# EAGLE design 89c2051-ps2-dec (EAGLE 4.16)
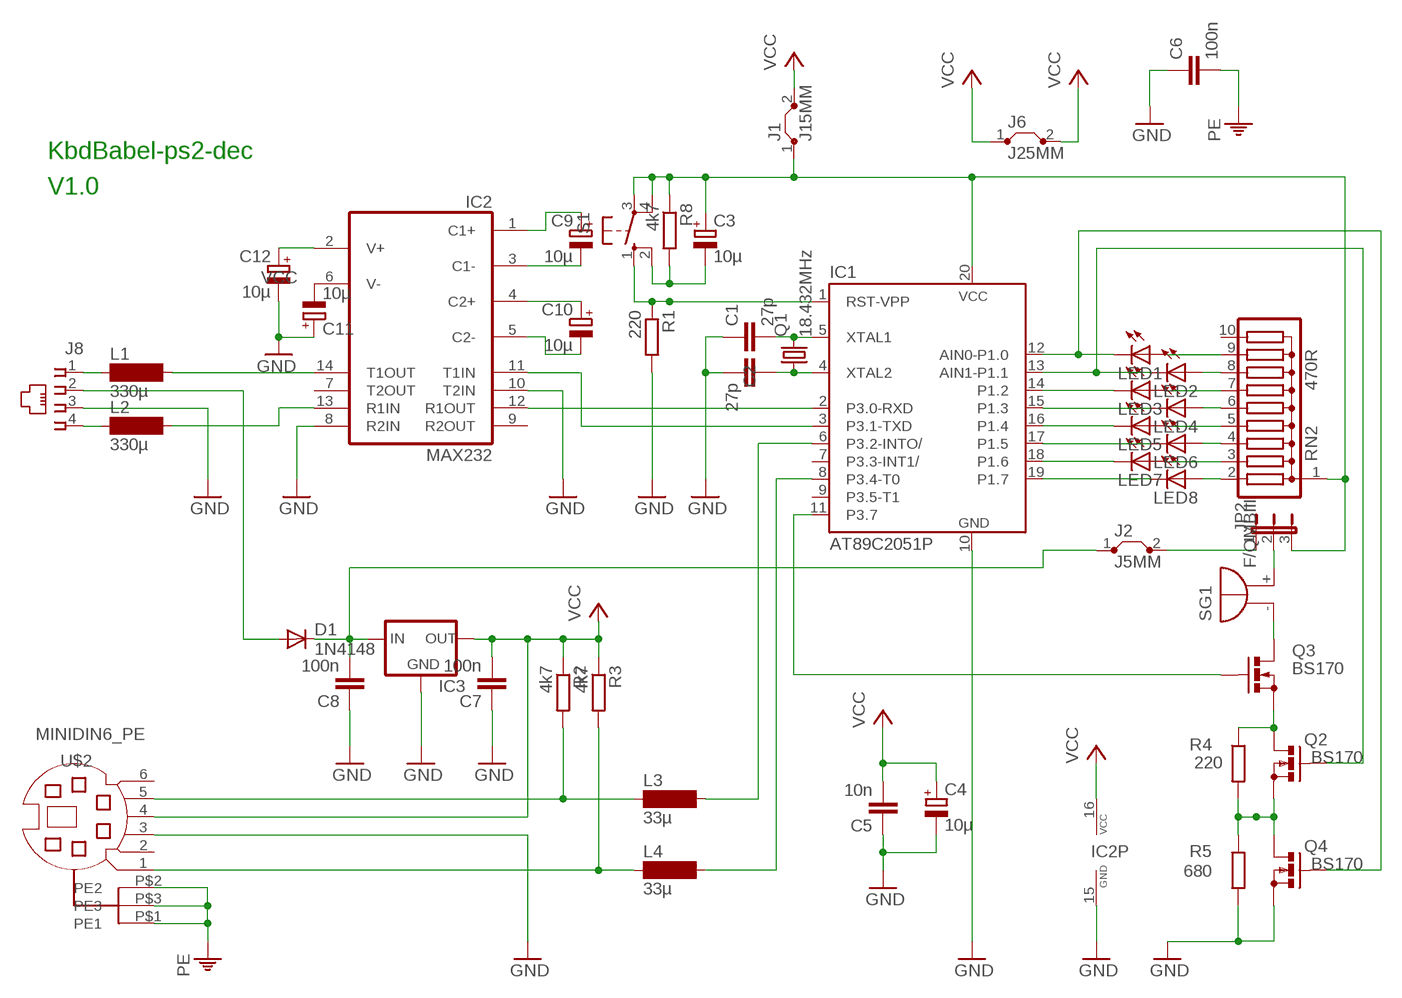
[diagram p0: schematic, sheet 1]

## Parts
C1  27p  C-EU025-030X050  [C025-030X050]
C2  27p  C-EU025-030X050  [C025-030X050]
C3  10µ  CPOL-EUE2.5-5  [E2,5-5]
C4  10µ  CPOL-EUE2.5-5  [E2,5-5]
C5  10n  C-EU025_050-025X075  [C025_050-025X075]
C6  100n  C-EU025_050-025X075  [C025_050-025X075]
C7  100n  C-EU025_050-025X075  [C025_050-025X075]
C8  100n  C-EU025_050-025X075  [C025_050-025X075]
C9  10µ  CPOL-EUE5-5  [E5-5]
C10  10µ  CPOL-EUE2-4  [E2-4]
C11  10µ  CPOL-EUE2-4  [E2-4]
C12  10µ  CPOL-EUE2-4  [E2-4]
D1  1N4148  [DO35-10]
IC1  AT89C2051P  [DIL20]
IC2  MAX232  [DIL16]
IC3  78XXL  [78XXL]
J1  J15MM  [15]
J2  J5MM  [05]
J6  J25MM  [25]
J8  520249-2  [520249-2]
JP2  JP2E  [JP2]
L1  330µ  SD75  [SD75]
L2  330µ  SD75  [SD75]
L3  33µ  SD75  [SD75]
L4  33µ  SD75  [SD75]
LED1  LEDSQR2X5  [LED2X5]
LED2  LEDSQR2X5  [LED2X5]
LED3  LEDSQR2X5  [LED2X5]
LED4  LEDSQR2X5  [LED2X5]
LED5  LEDSQR2X5  [LED2X5]
LED6  LEDSQR2X5  [LED2X5]
LED7  LEDSQR2X5  [LED2X5]
LED8  LEDSQR2X5  [LED2X5]
Q1  18.432MHz  CRYSTALHC49U70  [HC49U70]
Q2  BS170  [SOT54E]
Q3  BS170  [SOT54E]
Q4  BS170  [SOT54E]
R1  220  R-EU_0204/7  [0204/7]
R2  4k7  R-EU_0204/7  [0204/7]
R3  4k7  R-EU_0204/7  [0204/7]
R4  220  R-EU_0204/7  [0204/7]
R5  680  R-EU_0204/7  [0204/7]
R8  4k7  R-EU_0204/7  [0204/7]
RN2  470R  G09R  [SIL10]
S1  10-XX  [B3F-10XX]
SG1  F/QMBIII  [F/QMBIII]
U$2  MINIDIN6_PE  [MINIDIN6_PE]

## Nets
12VIN: C8.2 D1.C IC3.IN J2.1
GND: C1.1 C2.2 C4.- C5.1 C6.1 C7.1 C8.1 C11.+ C12.- IC1.10(GND) IC2.8(R2IN) IC2.10(T2IN) IC2.15(GND) IC3.GND J8.3 Q4.S R1.2 R5.2 U$2.3
N$1: C1.2 IC1.5(XTAL1) Q1.2
N$2: C2.1 IC1.4(XTAL2) Q1.1
N$4: LED1.A RN2.9
N$5: IC1.17(P1.5) LED6.K(C)
N$6: IC1.3(P3.1-TXD) IC2.11(T1IN)
N$7: J8.4 L2.1
N$8: IC1.13(AIN1-P1.1) LED2.K(C) Q2.G
N$9: IC2.13(R1IN) L2.2
N$10: C3.+ IC1.20(VCC) J1.1 JP2.3 R8.1 RN2.1 S1.3(P) S1.4(P1)
N$11: L3.1 R2.2 U$2.5
N$12: L4.1 R3.2 U$2.1
N$13: IC1.12(AIN0-P1.0) LED1.K(C) Q4.G
N$14: LED3.A RN2.7
N$15: IC1.15(P1.3) LED4.K(C)
N$16: LED5.A RN2.5
N$17: LED2.A RN2.8
N$18: LED4.A RN2.6
N$19: LED6.A RN2.4
N$20: IC1.18(P1.6) LED7.K(C)
N$21: LED8.A RN2.2
N$22: LED7.A RN2.3
N$23: IC1.19(P1.7) LED8.K(C)
N$24: IC1.16(P1.4) LED5.K(C)
N$25: IC1.14(P1.2) LED3.K(C)
N$26: IC1.2(P3.0-RXD) IC2.12(R1OUT)
N$28: IC1.11(P3.7) Q3.G
N$30: C10.+ IC2.4(C2+)
N$31: C10.- IC2.5(C2-)
N$32: J8.1 L1.1
N$33: C9.- IC2.3(C1-)
N$34: C9.+ IC2.1(C1+)
N$35: C11.- IC2.6(V-)
N$36: C12.+ IC2.2(V+)
N$39: IC2.14(T1OUT) L1.2
N$41: D1.A J8.2
N$42: J2.2 JP2.1
N$43: C3.- R8.2 S1.2(S1)
N$44: JP2.2 SG1.+(-)
N$45: Q2.D Q3.S R4.1
N$46: Q3.D SG1.-(+)
N$48: IC1.6(P3.2-INTO/) L3.2
N$49: IC1.8(P3.4-T0) L4.2
N$50: Q2.S Q4.D R4.2 R5.1
PE: C6.2 U$2.P$1(PE1) U$2.P$2(PE2) U$2.P$3(PE3)
RST: IC1.1(RST-VPP) R1.1 S1.1(S)
VCC: C4.+ C5.2 C7.2 IC2.16(VCC) IC3.OUT J1.2 J6.1 J6.2 R2.1 R3.1 U$2.4
Unconnected: IC1.7(P3.3-INT1/) IC1.9(P3.5-T1) IC2.7(T2OUT) IC2.9(R2OUT) RN2.10 U$2.2 U$2.6

## Notes on the sheet
- KbdBabel-ps2-dec
- V1.0

## Library data of the parts
C1 C2 C5-C8 = rcl:C-EU: CAPACITOR, European symbol
C3 C4 C9-C12 = rcl:CPOL-EU: POLARIZED CAPACITOR, European symbol
D1 = diode:1N4148: DIODE high speed (Philips)
IC1 = atmel:AT89C2051: 80C31 MICROCONTROLLER 2 Kbytes FLASH 2.7 V
IC2 = maxim:MAX232: RS232 TRANSEIVER
IC3 = v-reg:78XXL: VOLTAGE REGULATOR
J1 J2 J6 = jumper:J: Bridge
J8 = con-amp:520249-2: AMP connector
JP2 = jumper:JP2E: JUMPER
L1-L4 = inductor-neosid:SD75: INDUCTOR nominal inductance, E12
LED1-LED8 = led:LED: LED OSRAM: - CHIPLED LG R971, LG N971, LY N971, LG Q971, LY Q971, LO R971, LY R971 LH N974, LH R974 LS Q976, LO Q976, LY Q976 LO Q996 - Hyper CHIPLED LW Q18S LB Q993, LB Q99A, LB R99A - SideLED LS A670, LO A670, LY A670, LG A670, LP A670 LB A673, LV A673, LT A673, LW A673 LH A674 LY A675 LS A676, LA A676, LO A676, LY A676, LW A676 LS A679, LY A679, LG A679 - Hyper Micro SIDELED® LS Y876, LA Y876, LO Y876, LY Y876 LT Y87S - SmartLED LW L88C, LW L88S LB L89C, LB L89S, LG L890 LS L89K, LO L89K, LY L89K LS L896, LA L896, LO L896, LY L896 - TOPLED LS T670, LO T670, LY T670, LG T670, LP T670 LSG T670, LSP T670, LSY T670, LOP T670, LYG T670 LG T671, LOG T671, LSG T671 LB T673, LV T673, LT T673, LW T673 LH T674 LS T676, LA T676, LO T676, LY T676, LB T676, LH T676, LSB T676, LW T676 LB T67C, LV T67C, LT T67C, LS T67K, LO T67K, LY T67K, LW E67C LS E67B, LA E67B, LO E67B, LY E67B, LB E67C, LV E67C, LT E67C LW T67C LS T679, LY T679, LG T679 LS T770, LO T770, LY T770, LG T770, LP T770 LB T773, LV T773, LT T773, LW T773 LH T774 LS E675, LA E675, LY E675, LS T675 LS T776, LA T776, LO T776, LY T776, LB T776 LHGB T686 LT T68C, LB T68C - Hyper Mini TOPLED® LB M676 - Mini TOPLED Santana® LG M470 LS M47K, LO M47K, LY M47K Source: http://www.osram.convergy.de - LUMILED® LXK2-PW12-R00, LXK2-PW12-S00, LXK2-PW14-U00, LXK2-PW14-V00 LXK2-PM12-R00, LXK2-PM12-S00, LXK2-PM14-U00 LXK2-PE12-Q00, LXK2-PE12-R00, LXK2-PE12-S00, LXK2-PE14-T00, LXK2-PE14-U00 LXK2-PB12-K00, LXK2-PB12-L00, LXK2-PB12-M00, LXK2-PB14-N00, LXK2-PB14-P00, LXK2-PB14-Q00 LXK2-PR12-L00, LXK2-PR12-M00, LXK2-PR14-Q00, LXK2-PR14-R00 LXK2-PD12-Q00, LXK2-PD12-R00, LXK2-PD12-S00 LXK2-PH12-R00, LXK2-PH12-S00 LXK2-PL12-P00, LXK2-PL12-Q00, LXK2-PL12-R00 Source: www.luxeon.com
Q1 = crystal:CRYSTAL: CRYSTAL
Q2-Q4 = transistor-small-signal:BS170: N-CHANNEL MOS FET
R1-R5 R8 = rcl:R-EU_: RESISTOR, European symbol
RN2 = resistor-sil:G09R: SIL RESISTOR
S1 = switch-omron:10-XX: OMRON SWITCH
SG1 = buzzer:F/QMBIII: BUZZER Source: Buerklin
U$2 = bla:MINIDIN6_PE

## Board
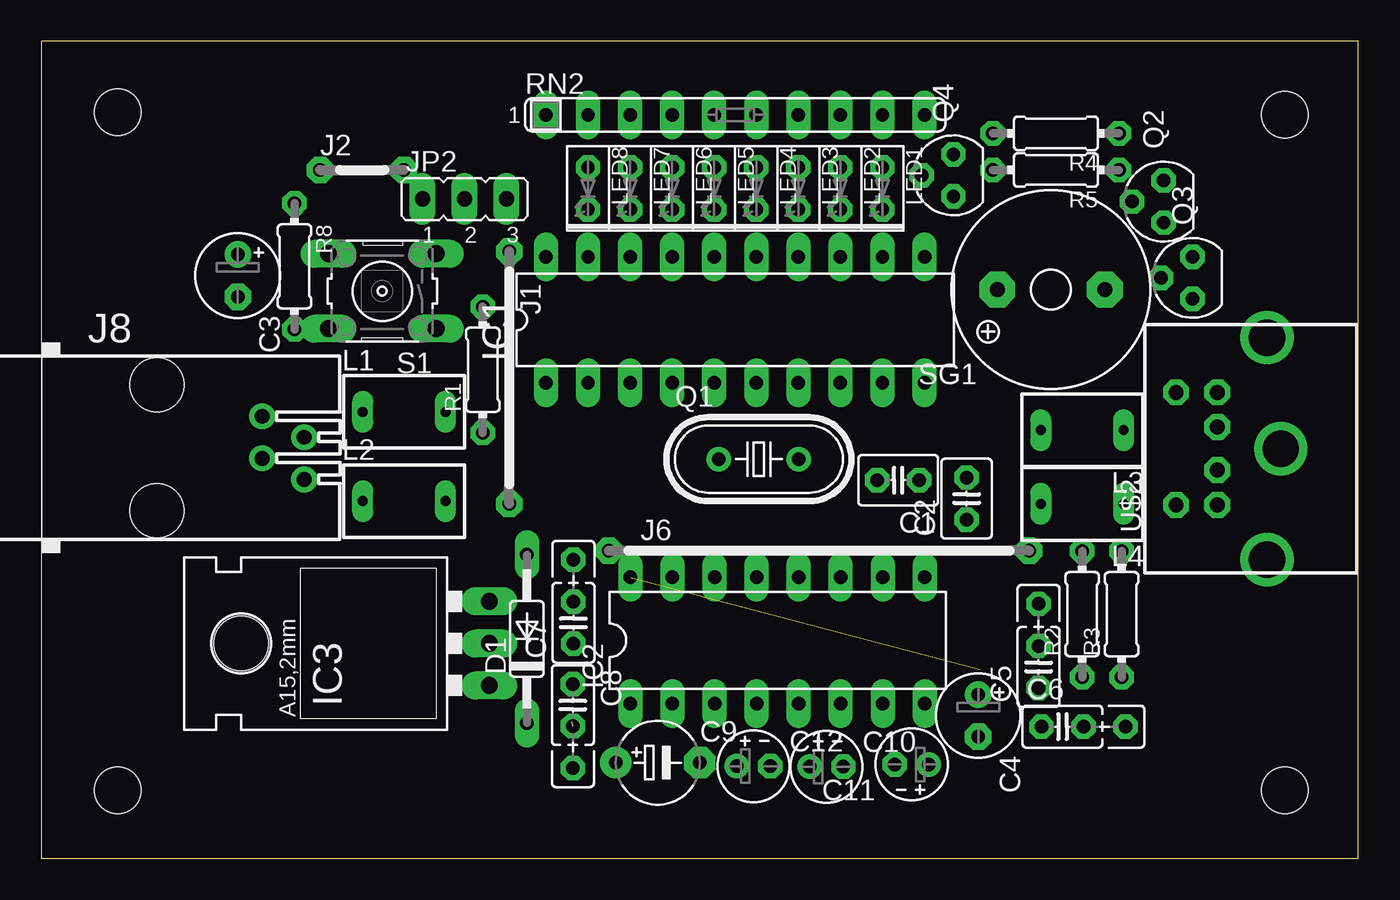
[diagram p1: board, top side]
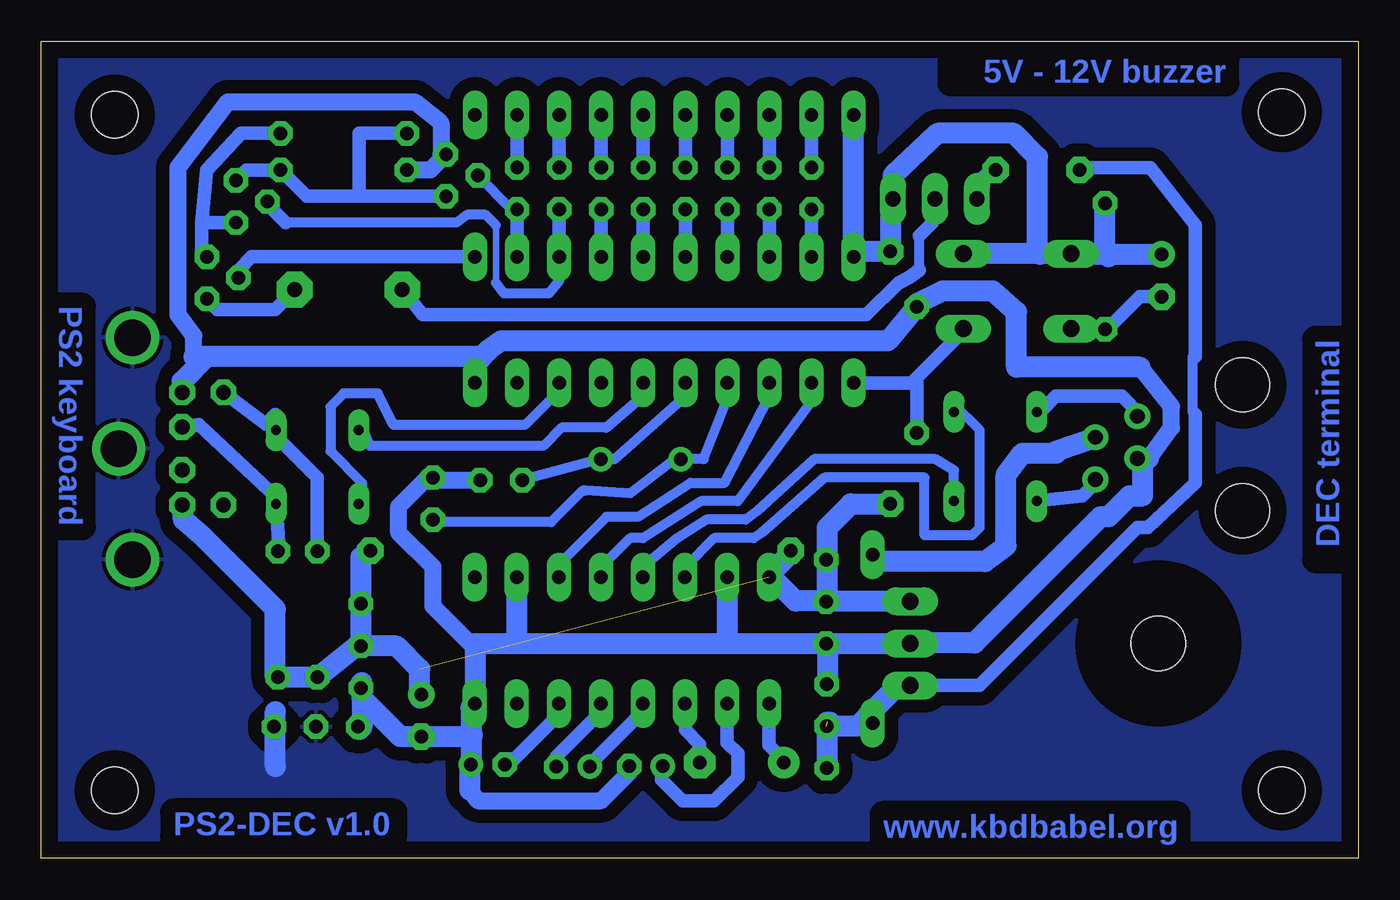
[diagram p2: board, bottom side, seen from below]

Size 79.52 x 49.36 mm. Coordinates in mm from the lower left corner, seen from the top.
Outline: 79.52,0 79.52,49.36 0,49.36 0,0 79.52,0
Copper layers (1*16): Top 0.035mm / dielectric 1.5mm / Bottom 0.035mm
Design rules "default": minimum track width 16mil, minimum drill 24mil, track to track 16mil, track to pad 16mil, pad to pad 16mil, via to via 16mil, smd to smd 16mil, copper to edge 40mil, drill to drill 8mil, minimum pad ring 13mil, minimum via ring 8mil, stop-mask expansion 4mil, vias tented up to drill 0mil, thermal gap 10mil
Holes 2.8 mm at 75.08,4.12 75.08,44.92 4.6,45.08 4.6,4.12

### Footprints (pad centres in the part's own frame; a part is rotated, then mirrored left to right if it is on the bottom)
C025-030X050 = drill 0.813 octagon: 1 -1.27,0; 2 1.27,0
E2,5-5 = drill 0.813 pad 1.6 round: + -1.27,0 | drill 0.813 pad 1.6 octagon: - 1.27,0
C025_050-025X075 = drill 0.813 octagon: 1 -1.27,0; 2 1.27,0; 3 3.81,0
E5-5 = drill 0.813 pad 1.905 round: + -2.54,0 | drill 0.813 pad 1.905 octagon: - 2.54,0
E2-4 = drill 0.813 pad 1.27 round: + -1.016,0 | drill 0.813 pad 1.27 octagon: - 1.016,0
DO35-10 = drill 0.813 long: A 5.08,0; C -5.08,0
DIL20 = drill 0.813 long: 1 -11.43,-3.81; 2 -8.89,-3.81; 3 -6.35,-3.81; 4 -3.81,-3.81; 5 -1.27,-3.81; 6 1.27,-3.81; 7 3.81,-3.81; 8 6.35,-3.81; 9 8.89,-3.81; 10 11.43,-3.81; 11 11.43,3.81; 12 8.89,3.81; 13 6.35,3.81; 14 3.81,3.81; 15 1.27,3.81; 16 -1.27,3.81; 17 -3.81,3.81; 18 -6.35,3.81; 19 -8.89,3.81; 20 -11.43,3.81
DIL16 = drill 0.813 long: 1 -8.89,-3.81; 2 -6.35,-3.81; 3 -3.81,-3.81; 4 -1.27,-3.81; 5 1.27,-3.81; 6 3.81,-3.81; 7 6.35,-3.81; 8 8.89,-3.81; 9 8.89,3.81; 10 6.35,3.81; 11 3.81,3.81; 12 1.27,3.81; 13 -1.27,3.81; 14 -3.81,3.81; 15 -6.35,3.81; 16 -8.89,3.81
78XXL = drill 1.016 long: GND 0,-3.81; IN -2.54,-3.81; OUT 2.54,-3.81 | hole 3.302: 0,11.176
15 = drill 0.813 pad 1.6 octagon: 1 -7.62,0; 2 7.62,0
05 = drill 0.813 pad 1.6 octagon: 1 -2.54,0; 2 2.54,0
25 = drill 0.813 pad 1.6 octagon: 1 -12.7,0; 2 12.7,0
520249-2 = drill 0.889 round: 1 -1.905,6.35; 2 -0.635,8.89; 3 0.635,6.35; 4 1.905,8.89 | hole 3.251: -3.81,0; 3.81,0
JP2 = drill 0.914 long: 1 -2.54,0; 2 0,0; 3 2.54,0
SD75 = drill 0.6 long: 1 -2.5,0; 2 2.5,0
LED2X5 = drill 0.813 octagon: A -1.27,0; K 1.27,0
HC49U70 = drill 0.813 round: 1 -2.413,0; 2 2.413,0
SOT54E = drill 0.813 octagon: D -1.27,0; G 0,1.905; S 1.27,0
0204/7 = drill 0.813 octagon: 1 -3.81,0; 2 3.81,0
SIL10 = drill 0.813 long: 1 -11.43,0; 2 -8.89,0; 3 -6.35,0; 4 -3.81,0; 5 -1.27,0; 6 1.27,0; 7 3.81,0; 8 6.35,0; 9 8.89,0; 10 11.43,0
B3F-10XX = drill 1.016 long: 1 -3.251,2.261; 2 3.251,2.261; 3 -3.251,-2.261; 4 3.251,-2.261
F/QMBIII = drill 0.914 pad 2.159 octagon: + 3.251,0; - -3.251,0
MINIDIN6_PE = drill 0.9 octagon: 1 1.3,2.15; 2 -1.3,2.15; 3 3.4,2.15; 4 -3.4,2.15; 5 3.4,4.65; 6 -3.4,4.65 | drill 2.2 round: P$1 0,-1.676; P$2 -6.706,-0.838; P$3 6.706,-0.838

### Placement (x,y rotation side)
C1  51.75,22.85 180 top
C2  55.88,21.74 90 top
C3  11.86,35.21 270 top
C4  56.58,8.63 270 top
C5  60.22,11.57 90 top
C6  61.67,7.96 0 top
C7  32.13,14.24 90 top
C8  32.1,9.26 270 top
C9  37.22,5.79 0 top
C10  47.42,5.54 0 top
C11  52.56,5.68 180 top
C12  43.01,5.58 0 top
D1  29.32,13.27 90 top
IC1  41.9,32.54 0 top
IC2  44.46,13.18 0 top
IC3  23.24,12.99 90 top
J1  28.25,29.05 270 top
J2  19.36,41.59 0 top
J6  46.97,18.59 0 top
J8  6.98,24.8 270 top
JP2  25.55,39.84 0 top
L1  21.9,26.98 0 top
L2  21.9,21.58 0 top
L3  62.86,25.87 180 top
L4  62.86,21.43 180 top
LED1  50.79,40.48 270 top
LED2  48.25,40.48 270 top
LED3  45.71,40.48 270 top
LED4  43.17,40.48 270 top
LED5  40.63,40.48 270 top
LED6  38.09,40.48 270 top
LED7  35.55,40.48 270 top
LED8  33.01,40.48 270 top
Q1  43.33,24.12 0 top
Q2  67.78,39.68 90 top
Q3  69.53,35.08 90 top
Q4  55.08,41.27 90 top
R1  26.65,29.52 90 top
R2  62.86,14.76 90 top
R3  65.24,14.76 90 top
R4  61.27,43.81 180 top
R5  61.27,41.59 180 top
R8  15.29,35.77 270 top
RN2  41.9,44.92 0 top
S1  20.58,34.27 180 top
SG1  60.98,34.37 180 top
U$2  73.18,24.76 90 top

### Tracks (layer width: path | path; a pad name or v marks a point on that pad's centre or on a via)
12VIN  (1 unrouted)
  Bottom 0.61: 9.84,26.82 10,26.98 10,30.31 9.84,30.31
  Bottom 0.813: IC3.IN 22.87,10.45 13.33,20 12.69,20 9.84,22.69 9.84,26.82 | 9.84,30.31 9.84,38.25 12.54,41.74 16.82,41.74 J2.1
  Bottom 1.27: IC3.IN 27.8,10.45 29.21,9.04 | 29.21,9.04 29.36,8.88 29.32,8.84 D1.C 29.32,8.93 29.21,9.04 | C8.2 30.25,7.99 29.21,9.04 | 31.9,8.25 32.06,8.25 32.06,5.39
GND
  Bottom 1.016: C12.- 44.03,5.18 45.71,3.49 53.18,3.49 53.65,4.12 | C11.+ 53.58,5.63 53.49,5.55 53.65,5.39 | 12.65,24.17 11.27,26.03 11.27,27.3 13.17,29.68 | 53.34,12.97 53.61,12.97 55.88,15.23 55.88,17.61 57.94,19.68 57.94,21.27 56.19,23.01 C2.2 55.72,23.01 55.56,22.85 C1.1 | Q4.S 54.92,42.7 | 70.32,30.16 70.32,30.31 70.32,31.58 71.27,32.85 71.27,41.74 68.26,45.71 56.99,45.71 55.4,44.44 55.4,42.54 Q4.S | R5.2 56.03,41.59 Q4.S
  Bottom 1.27: 53.65,5.39 53.65,4.12 | 26.82,13.01 26.84,12.99 IC3.GND | 53.34,9.37 53.34,9.36 | 53.34,9.37 IC2.8 53.34,9.37 53.34,9.36 | 50.79,12.97 53.34,12.97 53.34,9.37 | IC2.10 50.79,16.99 50.79,12.97 | C7.1 38.09,12.97 | 38.09,12.97 50.79,12.97 | 32.06,10.53 32.06,10.47 | 32.06,10.53 C8.1 | C7.1 32.06,12.97 32.06,10.53 | 27.14,12.99 27.14,13.01 | IC3.GND 27.14,12.99 | C7.1 27.14,12.97 27.14,12.99 | IC2.15 38.09,16.99 38.09,12.97 | 13.17,29.68 20.63,29.68 20.63,33.01 22.06,34.28 25.08,34.28 26.67,33.49 R1.2 28.41,31.27 51.75,31.27 52.58,30.68 | 53.58,7.45 53.58,9.12 53.34,9.36 | 53.58,7.45 C11.+ | 53.58,7.45 53.49,7.45 53.59,7.36 C4.- 57.84,7.36 60.16,9.68 | C5.1 60.22,10.57 60.16,10.63 60.16,9.68 | 52.58,30.68 53.34,30 | 12.85,24.17 12.65,24.17 | 12.85,24.17 J8.3 | 12.85,24.17 12.85,24.12 13.01,24.12 13.01,21.9 13.81,21.9 15.08,20.63 15.55,20.63 23.17,13.01 26.98,13.01 27,12.99 IC3.GND | 53.02,30.16 52.54,30.68 52.58,30.68 | 53.02,30.16 53.18,30 | C6.1 60.4,7.85 60.32,7.77 60.16,7.93 60.16,9.68 | U$2.3 71.03,28.81 69.53,30.31 | 53.02,30.16 | 53.02,30.16 | 53.34,30.31 53.18,30.31 53.02,30.16 | 53.34,30.31 69.53,30.31 | 53.34,30.31 IC1.10 | 53.34,30.31 | 69.53,30.31 70.32,30.31 | C2.2
N$1
  Bottom 0.61: IC1.5 40.63,27.93 44.92,24.12 46.03,24.12 Q1.2 C1.2 | C1.2
N$2
  Bottom 0.61: IC1.4 38.09,27.77 39.52,24.12 41.27,24.12 | 41.27,24.12 Q1.1 | 41.27,24.12 43.97,22.06 46.67,22.22 46.83,22.22 48.73,20.31 56.03,20.31 C2.1 | C2.1
N$4
  Bottom 0.813: LED1.A RN2.9
N$5
  Bottom 0.813: IC1.17 LED6.K
N$6
  Bottom 0.61: IC1.3 35.55,27.93 38.25,22.69 40.32,22.69 43.49,20.63 45.4,20.63 48.25,17.77 48.25,16.98 48.27,16.96 | 48.27,16.96 48.41,16.82 | 48.27,16.96 IC2.11
N$7
  Bottom 0.813: J8.4 15.71,22.85 16.66,21.9 L2.1
N$8
  Bottom 0.406: 52.06,34.76 52.06,38.25
  Bottom 0.61: 64.77,38.41 54.45,38.41 53.81,38.89 52.7,38.89 52.06,38.25 | 52.06,34.76 51.59,34.12 48.89,34.12 48.25,34.92 IC1.13 | IC1.13
  Bottom 0.813: Q2.G 65.88,39.52 64.77,38.41 | IC1.13 LED2.K
N$9
  Bottom 0.61: 43.17,16.98 43.17,17.61 41.11,19.36 39.36,20.47 36.98,20.47 36.35,20.95 32.86,24.12 25.55,24.12 24.4,23.45 L2.2
  Bottom 0.813: 43.17,16.98 43.18,16.99 IC2.13
N$10
  Bottom 1.27: 23.81,36.66 23.81,36.53 S1.3 19.2,36.53 | S1.4 17.14,36.53 17.14,36.51 | S1.4 19.2,36.53 | S1.4 17.46,36.66 | S1.4 | C3.+ 15.08,36.48 | 15.08,36.48 17.27,36.48 S1.4 | 15.08,36.48 15.08,36.35 15.29,36.56 R8.1 | JP2.3 28.09,41.27 25.39,43.81 20.79,43.81 19.36,42.38 19.36,36.66 19.2,36.51 19.2,36.53 | IC1.20 | IC1.20 RN2.1 | IC1.20 | 30.48,36.66 | 30.48,36.66 IC1.20 | 30.48,36.66 J1.1 28.25,39.68 JP2.3 | JP2.3
N$11
  Bottom 0.813: U$2.5 65.97,26.25 65.4,26.82 65.36,26.78 L3.1 65.36,26.62 65.4,26.66 65.4,25.55 62.86,23.01 R2.2
N$12
  Bottom 0.813: 65.24,21.74 | 65.24,21.74 L4.1 65.2,19.08 65.4,18.88 65.24,18.73 R3.2 | U$2.1 70.03,26.22 65.24,21.74
N$13
  Bottom 0.61: 53.34,41.27 Q4.G 51.11,39.2 LED1.K
  Bottom 0.813: IC1.12 | IC1.12 LED1.K | IC1.12
N$14
  Bottom 0.813: LED3.A RN2.7
N$15
  Bottom 0.813: IC1.15 LED4.K
N$16
  Bottom 0.813: LED5.A RN2.5
N$17
  Bottom 0.813: LED2.A RN2.8
N$18
  Bottom 0.406: LED4.A RN2.6
  Bottom 0.813: LED4.A RN2.6
N$19
  Bottom 0.406: LED6.A RN2.4
  Bottom 0.813: LED6.A RN2.4
N$20
  Bottom 0.813: IC1.18 LED7.K
N$21
  Bottom 0.813: LED8.A RN2.2
N$22
  Bottom 0.813: LED7.A RN2.3
N$23
  Bottom 0.813: IC1.19 LED8.K
N$24
  Bottom 0.813: IC1.16 LED5.K
N$25
  Bottom 0.813: IC1.14 LED3.K
N$26
  Bottom 0.61: IC1.2 33.02,27.62 37.46,21.58 39.68,21.58 43.17,19.36 43.97,19.36 45.71,17.61 45.71,16.98 45.72,16.99 IC2.12
N$28
  Bottom 0.813: Q3.G 67.62,35.55 66.83,36.35 IC1.11
N$30
  Bottom 0.813: IC2.4 43.19,8.9 43.17,8.88 46.41,5.65 C10.+
N$31
  Bottom 0.813: IC2.5 45.73,8.86 48.41,6.18 48.41,5.55 48.42,5.54 C10.-
N$32
  Bottom 0.813: J8.1 13.17,26.82 14.28,27.93 18.25,27.93 19.2,26.98 L1.1
N$33
  Bottom 0.813: C9.- 39.77,6.9 40.63,7.77 40.63,9.36 40.64,9.37 IC2.3
N$34
  Bottom 0.813: 34.44,5.55 C9.+ | C9.+ 34.6,5.87 35.57,6.84 IC2.1 | C9.+
N$35
  Bottom 0.813: IC2.6 48.27,8.71 50.95,6.03 51.27,6.03 51.59,5.71 51.56,5.68 C11.-
N$36
  Bottom 0.813: IC2.2 38.11,7 37.46,6.34 37.46,4.91 38.89,3.49 40.79,3.49 42.06,4.76 42.06,5.71 41.99,5.64 C12.+
N$39
  Bottom 0.61: L1.2 24.4,27.42 22.86,25.87 22.86,20 23.33,19.52 26.19,19.52 26.19,23.01 32.22,23.01 36.03,19.68 36.51,19.36 38.89,19.36 40.65,17.6 IC2.14
N$41
  Bottom 1.27: J8.2 18.25,24.6 18.25,24.49 20.27,24.49 21.27,23.17 21.27,18.88 22.54,17.93 29.21,17.93 29.32,19.16 | 29.32,19.16 29.36,19.2 | 29.32,19.16 D1.A
N$42
  Bottom 0.813: J2.2 22.06,41.74 23.01,40.79 JP2.1 | J2.2
N$43
  Bottom 0.813: C3.- 13.2,33.94 15.23,31.9 15.29,31.95 R8.2 17.4,31.96 | 17.4,31.96 17.35,32.01 S1.2 | 17.4,31.96 17.46,31.9
N$44
  Bottom 0.61: 26.51,35.55 26.51,37.62
  Bottom 0.813: JP2.2 25.55,38.89 25.71,38.73 25.71,38.41 26.51,37.62 | 26.51,35.55 27.14,35.08 27.78,34.76 29.68,32.85 56.51,32.85 57.73,34.39 | 57.73,34.39 57.78,34.44 | 57.73,34.39 SG1.+
N$45
  Bottom 0.813: R4.1 67.46,43.81 69.53,41.59 69.84,38.41 | Q3.S | 69.84,38.41 69.84,36.66 Q3.S | Q2.D 69.84,38.41 | 69.84,38.41
N$46
  Bottom 0.813: SG1.- 64.23,34.34 65.4,33.17 68.89,33.17 Q3.D | Q3.D
N$48
  Bottom 0.61: IC1.6 43.17,27.93 45.4,26.03 48.1,26.03 49.21,24.92 59.68,24.92 60.32,26.5 | 60.32,26.5 | 60.32,26.5 L3.2
N$49
  Bottom 0.61: IC1.8 48.25,28.25 50.32,26.19 58.26,26.19 59.21,28.09 61.27,28.09 62.07,27.3 62.07,24.6 60.16,22.69 60.16,21.74 | 60.16,21.74 | 60.16,21.74 L4.2
N$50
  Bottom 0.813: Q2.S 67.15,41.59 R5.1 63.49,40 60.32,40 | Q4.D 60.32,40 | R4.2 60.32,43.81 60.32,40
PE
  Bottom 1.27: 65.4,5.55 65.4,8.88
  pour Bottom (isolate 0.813): 79.69,-0.17 79.69,49.52 -0.16,49.52 -0.16,-0.17
RST
  Bottom 0.813: 23.7,32.01 23.65,32.06 | 23.7,32.01 S1.1 | IC1.1 26.98,28.73 26.82,28.89 | 26.82,28.89 23.7,32.01 | R1.1 26.65,28.71 26.82,28.89
VCC  (1 unrouted)
  Bottom 1.27: IC3.OUT 32.04,15.53 32.06,15.55 | J1.2 30.63,21.42 32.06,20 32.06,15.55 | 32.06,15.55 32.11,15.51 C7.2 32.18,15.51 32.22,15.55 33.97,15.55 35.4,16.99 IC2.16 35.57,17.12 34.13,18.57 34.15,18.59 J6.1 | 65.4,10.95 R3.1 | 65.4,10.95 R2.1 60.48,12.85 60.32,13.01 60.22,12.92 C5.2 | 65.4,10.95 | 65.4,10.95 65.4,15.07 69.84,19.52 70.96,20.47 70.96,21.11 71.12,21.27 U$2.4 | J6.2 59.67,18.71 59.68,18.73 60.22,18.19 C5.2 | C5.2 58.09,12.84 56.67,11.42 56.67,9.68 56.58,9.77 C4.+

### Text on the board
Bottom: 5V - 12V buzzer | PS2 keyboard | DEC terminal | www.kbdbabel.org | PS2-DEC v1.0